# Altium schematic sheet AICatRope V1.2.SchDoc
size A3
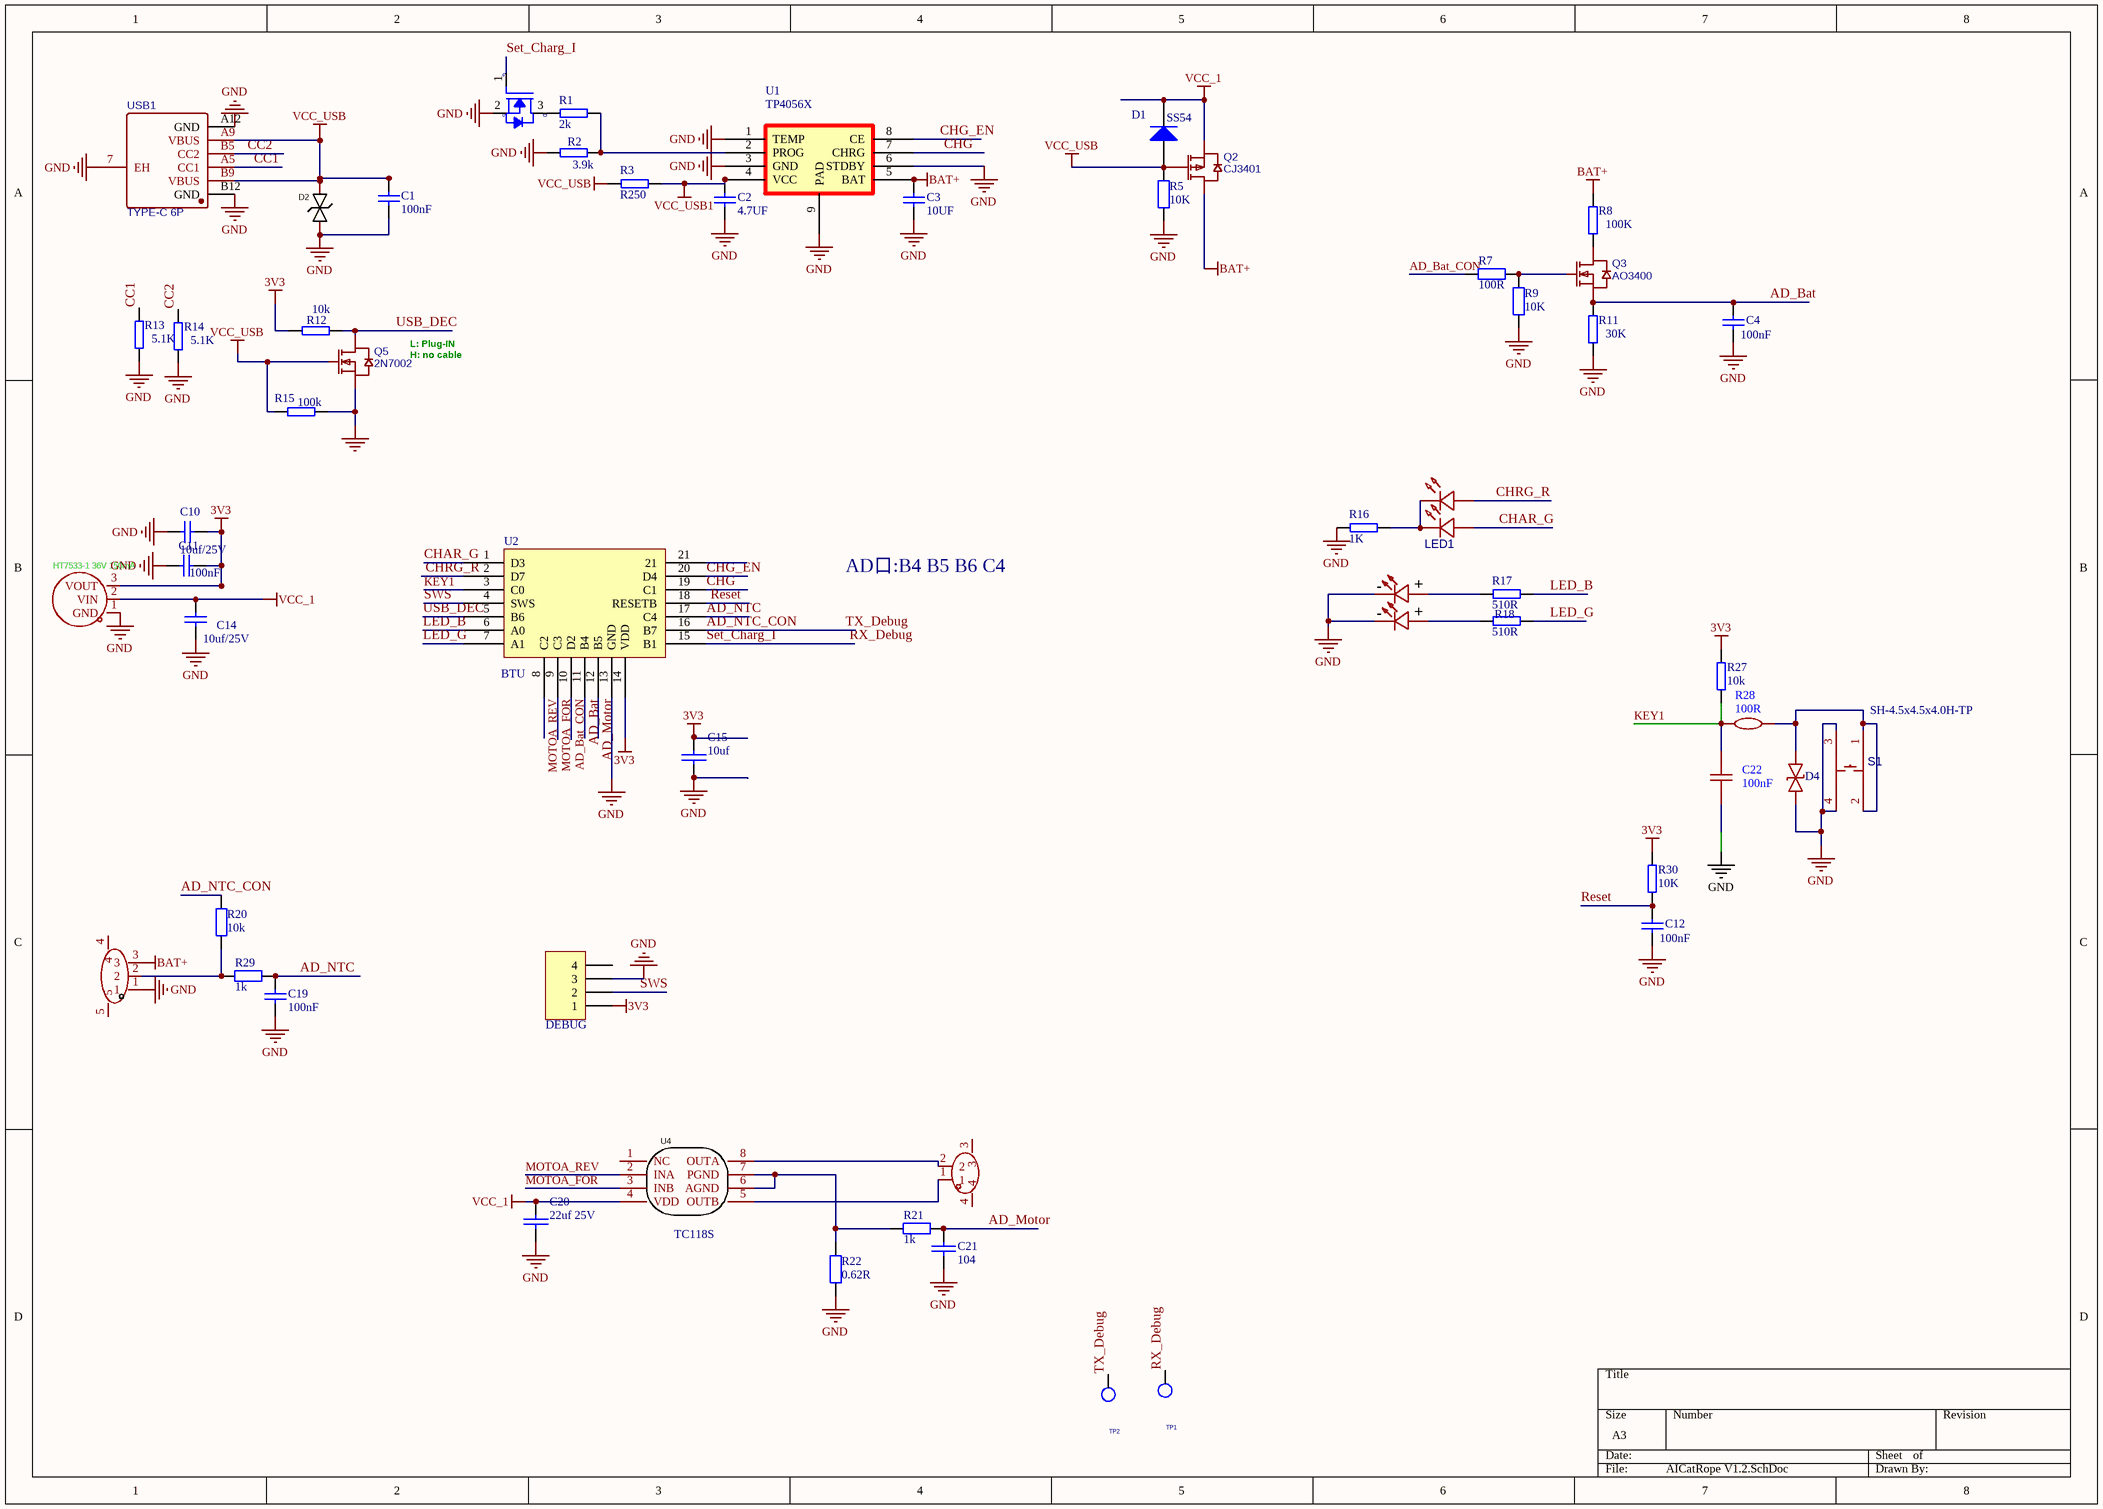
[diagram p0: AICatRope V1.2.SchDoc]

## Parts
BAT1  BX-PH2.0-3PWT  [CONN-SMD_2.0-3PLT]  (value not drawn)
C1  100nF  [0603_C]
C2  4.7UF  [0603_c]
C3  10UF  [0603_c]
C4  100nF  [0603_C]
C10  10uf/25V  [0603_c]
C11  100nF  [0603_C]
C12  100nF  [0603_C]
C14  10uf/25V  [0603_c]
C15  10uf  [0603_c]
C19  100nF  [0603_C]
C20  22uf 25V  [0805_C]
C21  104  [0603_C]
C22  100nF  [0603_c]
CN1  2.0-2P WT  [CONN-SMD_2.0-2PLT]  (value not drawn)
D1  SS54  [SMA]
D2  SMF6.0CA  [SOD-123 双向]  (value not drawn)
D4  (no value)  [SOD-523_L1.2-W0.8-LS1.6-RD]
LED1  XL-3216SURUGC  [LED-SMD_4P-L3.2-W1.6-TL_XL-3216SURUGC]  (value not drawn)
LED2  tj-s1615sw6tglcbg-a5  [LED-ARRAY-SMD_4P-L1.6-W1.5-TR-RD_TJ-S1615SW6TGLCRB-A5]  (value not drawn)
P1  DEBUG  [SIP3-2.54]
Q1  2N7002  [SOT-23]  (value not drawn)
Q2  CJ3401  [SOT-23]
Q3  AO3400  [SOT-23]
Q5  2N7002  [SOT-23]
R1  2k  [0603_R]
R2  3.9k  [0603_R]
R3  R250  [1206_R]
R5  10K  [0603_R]
R7  100R  [0603_r]
R8  100K  [0603_R]
R9  10K  [0603_r]
R11  30K  [0603_R]
R12  10k  [0603_R]
R13  5.1K  [0603_R]
R14  5.1K  [0603_R]
R15  100k  [0603_R]
R16  1K  [0603_R]
R17  510R  [0603_R]
R18  510R  [0603_R]
R20  10k  [0603_R]
R21  1k  [0603_R]
R22  0.62R  [1206_r]
R27  10k  [0603_R]
R28  100R  [0603_r]
R29  1k  [0603_R]
R30  10K  [0603_R]
S1  SH-4.5x4.5x4.0H-TP  [SW-SMD_4P-SH-4.5X4.5X4.0H-TP]
TP1  (no value)  [TP]
TP2  (no value)  [TP]
U1  TP4056X  [SOP8-9]
U2  BTU  [BTU]
U3  HT7533-1 36V 150mA  [SOT-89_L4.5-W2.5-P1.50-LS4.2-BR]
U4  TC118S  [SOP8-9]
USB1  TYPE-C 6P  [TPYE-C-6]

## Nets
3V3: C10.2 C11.1 C15.2 P1.1 R12.1 R27.2 R30.1 U2.14(VDD) U3.3(VOUT)
BAT+: BAT1.3 C3.2 Q2.3(D) R8.1 U1.5(BAT)
GND: BAT1.1 C1.2 C2.1 C3.1 C4.1 C10.1 C11.2 C12.1 C14.1 C15.1 C19.2 C20.1 C21.1 C22.1 D2.1 D4.1 LED2.2 LED2.4 P1.3 Q1.2(SOURCE) Q5.2(S) R2.1 R5.1 R9.1 R11.2 R13.2 R14.2 R15.2 R16.1 R22.1 S1.3 S1.4 U1.1(TEMP) U1.3(GND) U1.6(STDBY) U1.9(PAD) U2.13(GND) U3.1(GND) USB1.7(EH) USB1.A12(GND) USB1.B12(GND)
VCC_1: C14.2 C20.2 D1.2(K) Q2.2(S) U3.2(VIN) U4.4(VDD)
VCC_USB: C1.1 D1.1(A) D2.2 Q2.1(G) Q5.1(G) R3.2 R5.2 R15.1 USB1.A9(VBUS) USB1.B9(VBUS)
VCC_USB1: C2.2 R3.1 U1.4(VCC)
AD_Bat: C4.2 Q3.2(S) R11.1 U2.11(B4)
AD_Bat_CON: R7.2 U2.10(D2)
AD_Motor: C21.2 R21.1 U2.12(B5)
AD_NTC: C19.1 R29.1 U2.17(C4)
AD_NTC_CON: R20.2 TP2.1(TP) U2.16(B7)  [also labelled TX_Debug]
CC1: R13.1 USB1.A5(CC1)
CC2: R14.1 USB1.B5(CC2)
CHAR_G: LED1.3(A) U2.1(D3)
CHG: U1.7(CHRG) U2.19(C1)
CHG_EN: U1.8(CE) U2.20(D4)
CHRG_R: LED1.1(A) U2.2(D7)
KEY1: C22.2 R27.1 R28.2 U2.3(C0)
LED_B: R17.2 U2.6(A0)
LED_G: R18.2 U2.7(A1)
MOTOA_FOR: U2.9(C3) U4.3(INB)
MOTOA_REV: U2.8(C2) U4.2(INA)
Reset: C12.2 R30.2 U2.18(RESETB)
RX_Debug: Q1.1(GATE) TP1.1(TP) U2.15(B1)  [also labelled Set_Charg_I]
SWS: P1.2 U2.4(SWS)
USB_DEC: Q5.3(D) R12.2 U2.5(B6)
NetBAT1_2: BAT1.2 R20.1 R29.2
NetCN1_1: CN1.1 U4.5(OUTB)
NetCN1_2: CN1.2 U4.8(OUTA)
NetD4_2: D4.2 R28.1 S1.1 S1.2
NetLED1_2: LED1.2(K) LED1.4(K) R16.2
NetLED2_1: LED2.1 R17.1
NetLED2_3: LED2.3 R18.1
NetQ1_3: Q1.3(DRAIN) R1.1
NetQ3_1: Q3.1(G) R7.1 R9.2
NetQ3_3: Q3.3(D) R8.2
NetR1_2: R1.2 R2.2 U1.2(PROG)
NetR21_2: R21.2 R22.2 U4.6(AGND) U4.7(PGND)

Not connected (* = marked no-connect by the designer): BAT1 4 5; CN1 3 4; P1 4; U2 21; U4 1(NC)

## Notes on the sheet
- L: Plug-IN
  H: no cable
- AD口:B4 B5 B6 C4
- (in symbol AO3400_SOT23) G; S; D
- (in symbol tj-s1615sw6tglcbg-a5) +

## Library data of the parts
BAT1 = BX-PH2.0-3PWT: Add into BOM: yes; Pins Structure: 1x3P; Pitch: 2mm; Reference Series: PH; Number of PINs Per Row: 3; Current Rating: 2A; Voltage Rating: 250V; Plastic Material: LCP; Z-Height of the Board: 5.6mm; X-Length of Bottom Edge on Board (Spacing Line): 10mm; Y-Width of Bottom Edge on Board: 8.5mm; Symbol: BX-PH2.0-3P WT; Device: BX-PH2.0-3PWT; Supplier Part: C18077891; Manufacturer Part: BX-PH2.0-3PWT; JLCPCB Part Class: Extended Part; Datasheet: https://atta.szlcsc.com/upload/public/pdf/source/20231017/BD792FFC28D3713F37031213153FD38E.pdf; Supplier: LCSC; Convert to PCB: yes; Number of Pins: 3P; Number of Rows: 1; Row Spacing: -; Flame Retardant Rating: -
C1-C4 C11 C12 C19 = CAP
C10 C14 = Cap1: 无极电容
C15 C20 = C-0603: C-?-K-0603; CompNAME: 贴片电容; $MaterialClass: Component; $MaterialID: 12063014; CompCLASSIFICATION: ;电子元器件; Comp_Spec: C-104-50V-X7R-M-0603; CompID: 12063014
C21 = CAP: Capacitor
C22 = CAP_0603: Symbol: CapAcitance; Convert to PCB: yes; Device: CAP_0603; Add into BOM: yes; Supplier Footprint: 0603; Value: 100nF
CN1 = 2.0-2P WT: Add into BOM: yes; Pins Structure: 1x2P; Pitch: 2mm; Reference Series: PH; Number of PINs Per Row: 2; Current Rating: 2A; Voltage Rating: 250V; Plastic Material: LCP; Flame Retardant Rating: UL94V-0; Symbol: 2.0-2P WT; Device: 2.0-2P WT; Supplier Part: C668620; Manufacturer Part: 2.0-2P WT; JLCPCB Part Class: Extended Part; Datasheet: https://atta.szlcsc.com/upload/public/pdf/source/20200618/C668620_23A1268D02446CDAEF4211C80D6A413F.pdf; Supplier: LCSC; Convert to PCB: yes; Number of Pins: 2P; Number of Rows: 1; Row Spacing: -
D1 = Diode 1N4148: High Conductance Fast Diode; Published: 8-Jun-2000; LatestRevisionDate: 17-Jul-2002; LatestRevisionNote: Re-released for DXP Platform.; DatasheetVersion: 1997; PackageReference: DO-35; Publisher: Altium Limited; PackageDescription: Diode, Axial; Body 3.8 x 1.9 mm (LxDia. max), Lead Dia. 0.53 mm (max); Code_JEDEC: DO-204-AH; ComponentLink1Description: Manufacturer Link; ComponentLink1URL: http://www.fairchildsemi.com/; ComponentLink2Description: Datasheet; ComponentLink2URL: http://www.fairchildsemi.com/ds/1N%2F1N4148.pdf
D2 = SMF5.0CA_C726939: Add into BOM: yes; Symbol: SMF5.0CA_C726939; Device: SMF5.0CA_C726939; Supplier: LCSC; Supplier Part: C726939; Manufacturer Part: SMF5.0CA; JLCPCB Part Class: Extended Part; LCSC Part Name: SMF5.0CA; Supplier Footprint: SOD-123FL; Datasheet: https://atta.szlcsc.com/upload/public/pdf/source/20200825/C726891_B615A55314C94A3B16B7FBCD32D40567.pdf; Convert to PCB: yes
D4 = LESD5Z5.0CT1G: Add into BOM: yes; Reverse Stand-Off Voltage (Vrwm): 5V; Maximum Clamping Voltage: 18.6V; Peak Pulse Current (Ipp)@10/1000us: 9.4A; Breakdown Voltage: 5.6V; Type: ESD; Symbol: LESD5Z5.0CT1G; Device: LESD5Z5.0CT1G; Supplier: LCSC; Manufacturer Part: LESD5Z5.0CT1G; Supplier Part: C136167; Supplier Footprint: SOD-523; Datasheet: https://atta.szlcsc.com/upload/public/pdf/source/20171026/C136167_15089841930291059137.pdf; Convert to PCB: yes
LED1 = TJ-S2012SW8TCGLC2R2G-A5: Symbol: TJ-S2012SW8TCGLC2R2G-A5
LED2 = tj-s1615sw6tglcbg-a5: AddInBom: yes; ModelId: 975fc777d3fe49e09c3910781fba1574; ModelName: LED-ARRAY-SMD_4P-L1.6-W1.5-H0.6-P0.8; ModelTransform: 62.992,59.05894,0,0,0,0,0,0,0; Voltage - Forward(Vf): 2.8V~3.4V; Power(Watts): 108mW; Forward Current: 20mA; Symbol: TJ-S1615SW6TGLCBG-A5; SupplierPart: C273609; ManufacturerPart: TJ-S1615SW6TGLCBG-A5; Supplier Footprint: SMD-4P,1.6x1.5mm; JLCPCB Part Class: Extended Part; Datasheet: https://item.szlcsc.com/datasheet/TJ-S1615SW6TGLCBG-A5/261953.html; Supplier: LCSC; ConvertToPcb: yes; FootprintName: LED-ARRAY-SMD_4P-L1.6-W1.5-TR-RD_TJ-S1615SW6TGLCRB-A5; Lamp Holder Type: -; Color Temperature: -; Mounting Style: -
P1 = Header 4: Header, 4-Pin; LatestRevisionDate: 17-Jul-2002; LatestRevisionNote: Re-released for DXP Platform.; Publisher: Altium Limited
Q1 = AO3400_SOT23: BOM: N-Channel EMFET 2N7002 SOT23 <FAIRCHILD>; COST(NT$): 4.69
Q2 = CJ3401: BOM_Manufacturer: CJ; BOM_Supplier: LCSC; BOM_Manufacturer Part: CJ3401; BOM_Supplier Part: C13799; BOM_JLCPCB Part Class: Extended Part; spicePre: Q; spiceSymbolName: CJ3401
Q3 Q5 = JMTL3400A: Contributor: LCSC; BOM_Supplier: LCSC; BOM_Supplier Part: C2890442; BOM_Manufacturer Part: JMTL3400A; BOM_JLCPCB Part Class: Extended Part; spicePre: Q; spiceSymbolName: JMTL3400A
R1-R3 R8 R11-R18 R27 R30 = RES
R5 R7 R9 R20-R22 R29 = Res2: Resistor; Value: 120R; Published: 8-Jun-2000; LatestRevisionDate: 17-Jul-2002; LatestRevisionNote: Re-released for DXP Platform.; PackageReference: AXIAL-0.4; Publisher: Altium Limited
R28 = Res_0603: Convert to PCB: yes; Device: Res_0603; Add into BOM: yes; Supplier Footprint: 0603; Value: 100R
S1 = TS-1002S-05026C: Symbol: TS-1002S-05026C
TP1 TP2 = T POINT R
U1 = TP4056
U3 = HT7533-1_C347186: Add into BOM: yes; Maximum Input Voltage: 30V; Output Voltage: 3.3V; Output Current: 100mA; Dropout Voltage: 100mV@(1mA); standby current: 3uA; Number of Outputs: 1; Symbol: HT7533-1_C347186; Device: HT7533-1_C347186; Supplier Part: C347186; Manufacturer Part: HT7533-1; Supplier Footprint: SOT-89; JLCPCB Part Class: Extended Part; Datasheet: https://atta.szlcsc.com/upload/public/pdf/source/20241210/442D8F583BE08BBCCA568BF38D964031.pdf; Supplier: LCSC; Convert to PCB: yes; Power Supply Rejection Ratio (PSRR): -; Noise: -
U4 = TC118S: Add into BOM: yes; Name: TC118S; Symbol: TC118S; Device: TC118S; LCSC Part Name: TC118S; Supplier Part: C88308; Manufacturer Part: TC118S; Supplier Footprint: SOP-8_150mil; JLCPCB Part Class: Extended Part; Datasheet: https://atta.szlcsc.com/upload/public/pdf/source/20161129/1480413782462.pdf; Supplier: LCSC; Convert to PCB: yes
USB1 = TYPE-C 6P: BOM_Manufacturer: SHOU HAN; Contributor: LCSC; BOM_Supplier: LCSC; BOM_Supplier Part: C456012; BOM_Manufacturer Part: TYPE-C 6P; BOM_JLCPCB Part Class: Extended Part; spicePre: U; spiceSymbolName: TYPE-C 6P